# EAGLE design QRE1113_breakout_schmitt (EAGLE 7.1.0)
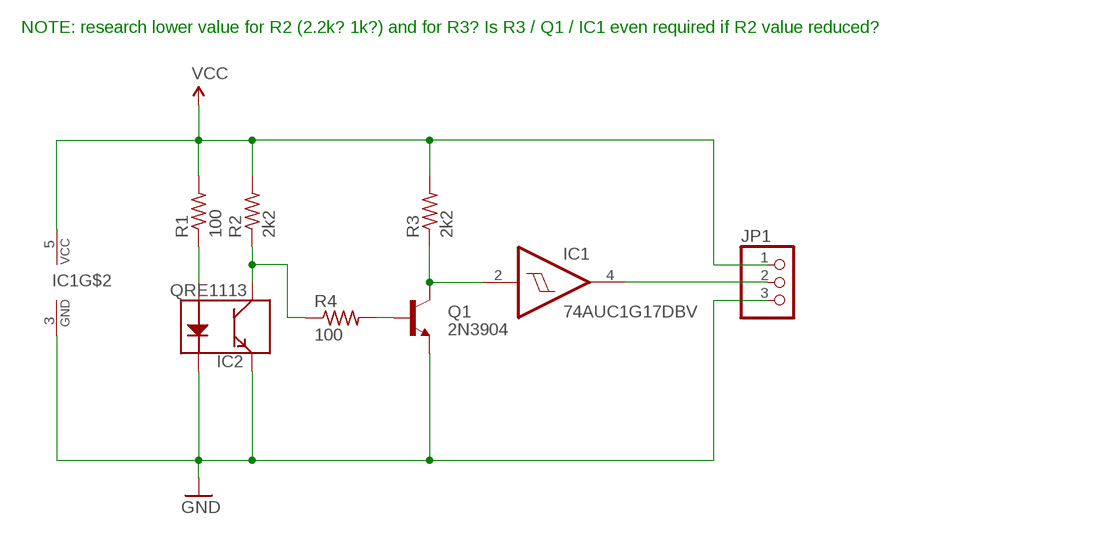
[diagram p0: schematic, sheet 1]

## Parts
IC1  74AUC1G17DBV  [SOT23-5]
IC2  QRE1113  [QRE1113]
JP1  PINHD-1X03_2.54-S  [1X03-S]
Q1  2N3904  2N3904SMD  [SOT-23]
R1  100  R-US_R0603  [R0603]
R2  2k2  R-US_R0603  [R0603]
R3  2k2  R-US_R0603  [R0603]
R4  100  R-US_R0603  [R0603]

## Nets
GND: IC1.3(GND) IC2.2(K) IC2.4(E) JP1.3 Q1.2(E)
N$1: IC2.3(C) R2.1 R4.1
N$2: IC2.1(A) R1.1
N$4: IC1.2(I) Q1.1(C) R3.1
N$5: Q1.3(B) R4.2
SIG: IC1.4(O) JP1.2
VCC: IC1.5(VCC) JP1.1 R1.2 R2.2 R3.2

## Notes on the sheet
- NOTE: research lower value for R2 (2.2k? 1k?) and for R3? Is R3 / Q1 / IC1 even required if R2 value reduced?

## Library data of the parts
IC1 = 74xx-little-us:74*1G17: Single Schmitt-Trigger Buffer
IC2 = SparkFun:QRE1113
JP1 = pinhead-2:PINHD-1X03: PIN HEADER
Q1 = mes_transistors:2N3904: NPN Transistor Small signal NPN Bipolar Junction Transistor (BJT). Use this device to represent any of a number of such transistors with similar package and pinout: 2N4401, 2N3904, 2N2222, etc.
R1-R4 = rcl:R-US_: RESISTOR, American symbol

## Board
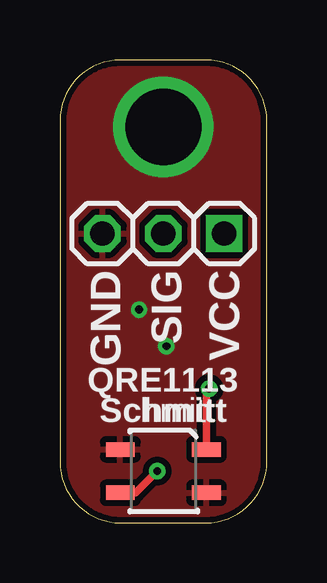
[diagram p1: board, top side]
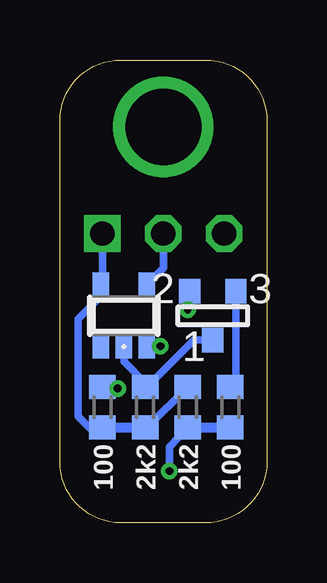
[diagram p2: board, bottom side, seen from below]

Size 8.64 x 19.3 mm. Coordinates in mm from the lower left corner, seen from the top.
Outline: 6.1,19.3 2.54,19.3 arc90 0,16.76 0,2.54 arc90 2.54,0 6.1,0 arc90 8.64,2.54 8.64,16.76 arc90 6.1,19.3
Copper layers (1*16): Top 0.0356mm / dielectric 1.5011mm / Bottom 0.0356mm
Design rules "LaenPCBOrder": minimum track width 6mil, minimum drill 13mil, track to track 10mil, track to pad 10mil, pad to pad 10mil, via to via 10mil, smd to smd 8mil, copper to edge 10mil, drill to drill 10mil, minimum pad ring 7mil, minimum via ring 7mil, stop-mask expansion 3mil, vias tented up to drill 20mil, thermal gap 10mil

### Footprints (pad centres in the part's own frame; a part is rotated, then mirrored left to right if it is on the bottom)
SOT23-5 = smd 0.69 x 0.99: 1 -0.95,-1.29; 2 0,-1.29; 3 0.95,-1.29; 4 0.95,1.3; 5 -0.95,1.3
QRE1113 = smd 1.2 x 0.6: 1 -1.8,-0.9; 2 1.8,-0.9; 3 1.8,0.9; 4 -1.8,0.9
1X03-S = drill 1.016 square: 1 -2.54,0 | drill 1.016 octagon: 2 0,0; 3 2.54,0
SOT-23 = smd 0.889 x 1.016: 1 0.025,-1.016; 2 -0.94,1.016; 3 0.991,1.016
R0603 = smd 1 x 1.1: 1 -0.85,0; 2 0.85,0

### Placement (x,y rotation side)
IC1  5.97,8.64 0 bottom
IC2  4.32,2.16 180 top
JP1  4.32,12.06 180 top
Q1  2.29,8.64 0 bottom
R1  6.86,4.83 270 bottom
R2  3.3,4.83 90 bottom
R3  5.08,4.83 270 bottom
R4  1.52,4.83 90 bottom

### Tracks (layer width: path | path; a pad name or v marks a point on that pad's centre or on a via)
GND  (via drill 0.33, 3.17)
  Bottom 0.406: Q1.2 3.23,8.97 v3.3,8.89 | IC1.3 4.55,7.35 v4.45,7.37
  other vias: 4.32,16.51
  pour Top: 0,2.54 0,16.76 arc-90 2.54,19.3 6.1,19.3 arc-90 8.64,16.76 8.64,2.54 arc-90 6.1,0 2.54,0 arc-90
N$1  (via drill 0.33)
  Top 0.305: IC2.3 3.16,1.26 v4.06,2.16
  Bottom 0.305: v4.06,2.16 4.06,3.17 R2.1
  Bottom 0.406: 1.4,3.94 1.18,3.98 R4.1 R2.1
N$2  (via drill 0.33)
  Top 0.305: IC2.1 6.12,5.49 v6.22,5.6
  Bottom 0.406: R1.1 6.3,5.68 v6.22,5.6
N$4
  Bottom 0.305: IC1.2 5.97,6.73 5.08,5.84 R3.1 4.99,5.68 3.05,7.62 Q1.1
N$5
  Bottom 0.305: Q1.3 1.29,5.91 R4.2
SIG
  Bottom 0.305: JP1.2 4.32,10.64 IC1.4
VCC
  Bottom 0.305: JP1.1 6.86,10 IC1.5 6.92,9.46 7.87,8.51 7.87,4.45 7.37,3.94 6.9,3.94 R1.2 | 5,3.98 R2.2
  Bottom 0.406: R1.2 R3.2 5,3.98

### Text on the board
tNames: GND | SIG | VCC | QRE1113 | Schmitt
tsilk: GND | SIG | VCC | QRE1113 | Schmitt
bsilk: 100 | 2k2 | 2k2 | 100